# EAGLE schematic core (EAGLE 9.4.2), part 2 of 2
## Sheet 13 of 13: Connector
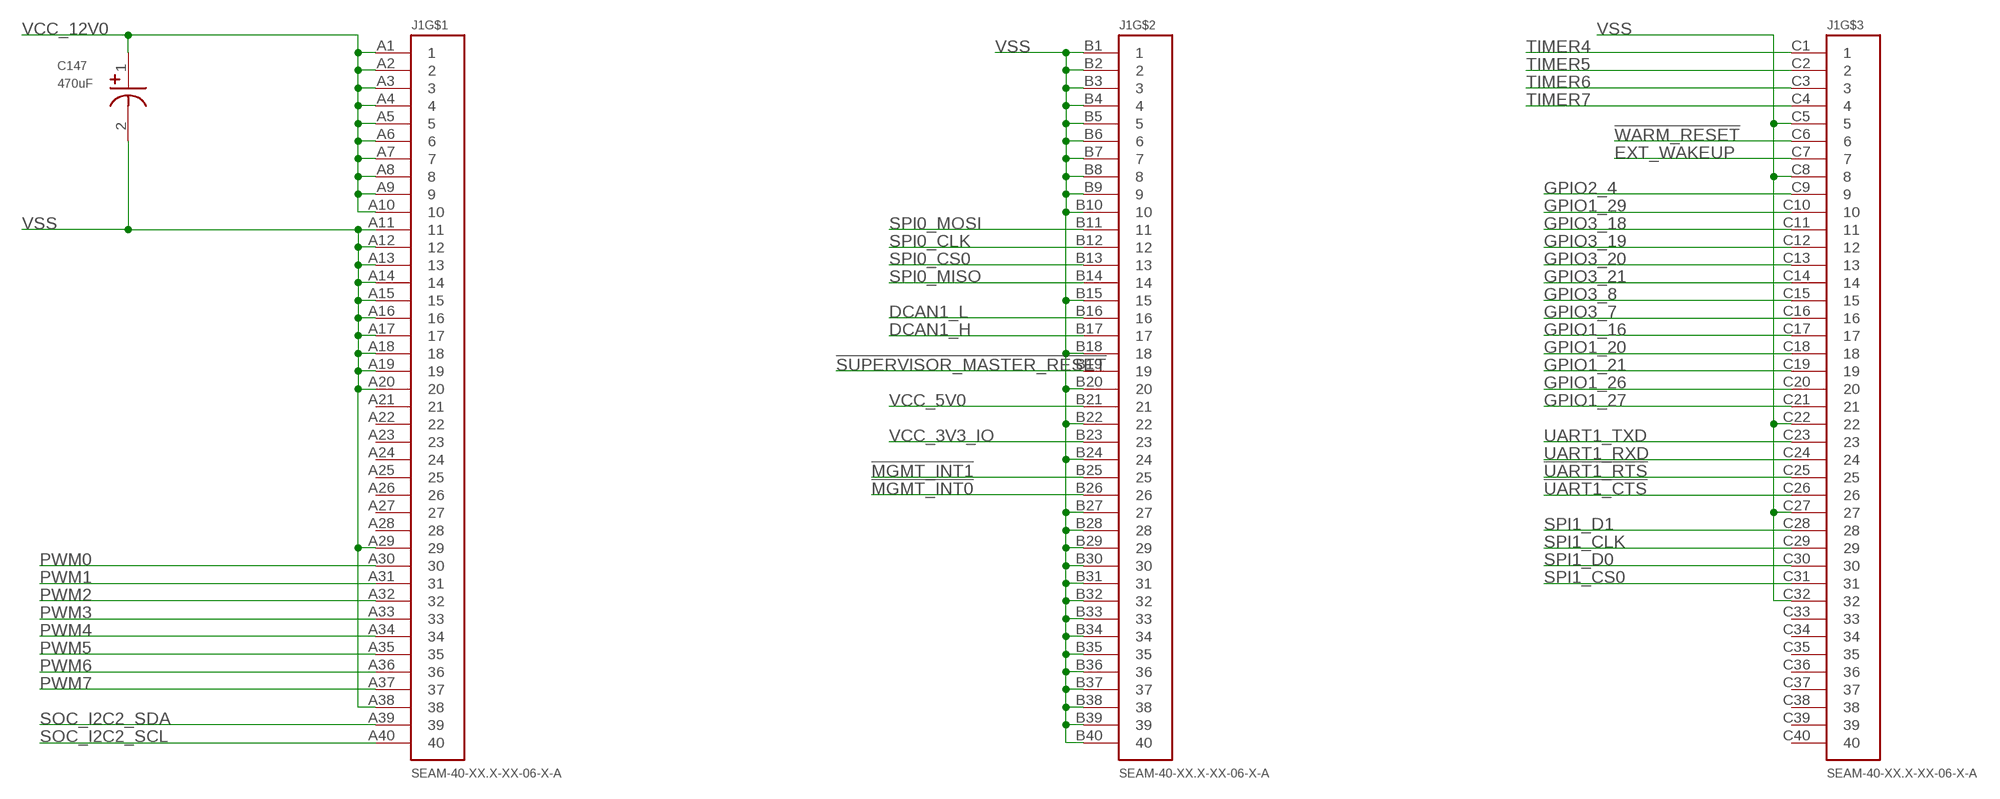
[diagram p14: schematic, sheet 13, part 1 of 2]
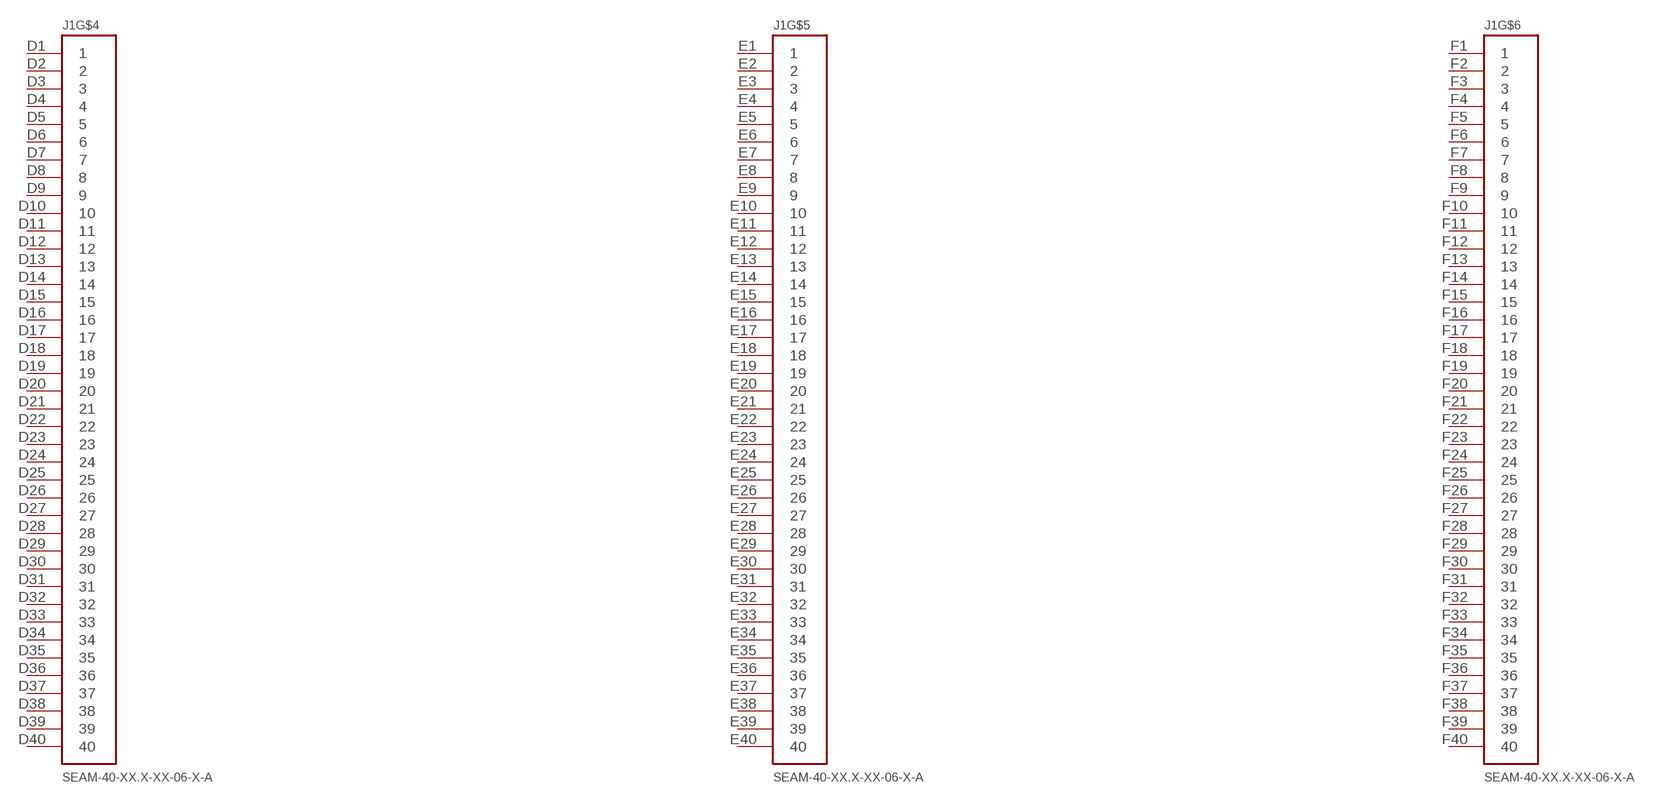
[diagram p15: schematic, sheet 13, part 2 of 2]

### Parts
C147  470uF  CAPACITOR_POLARIZED1  [CAPPRD300W65D800H1200B]
J1  SEAM-40-XX.X-XX-06-X-A  [SEAM-40-XX.X-XX-06-X-A]

### Nets
!MGMT_INT0: J1.B26 ; also sheet 12
!MGMT_INT1: J1.B25 ; also sheet 12
!SUPERVISOR_MASTER_RESET: J1.B19 ; also sheet 11
!UART1_CTS: J1.C26 ; also sheet 1
!UART1_RTS: J1.C25 ; also sheet 1
!WARM_RESET: J1.C6 ; also sheet 1
DCAN1_H [6mil]: J1.B17 ; also sheet 1
DCAN1_L [6mil]: J1.B16 ; also sheet 1
EXT_WAKEUP: J1.C7 ; also sheet 1,12
GPIO1_16: J1.C17 ; also sheet 1
GPIO1_20: J1.C18 ; also sheet 1
GPIO1_21: J1.C19 ; also sheet 1
GPIO1_26: J1.C20 ; also sheet 1
GPIO1_27: J1.C21 ; also sheet 1
GPIO1_29: J1.C10 ; also sheet 1
GPIO2_4: J1.C9 ; also sheet 1
GPIO3_7: J1.C16 ; also sheet 1
GPIO3_8: J1.C15 ; also sheet 1
GPIO3_18: J1.C11 ; also sheet 1
GPIO3_19: J1.C12 ; also sheet 1
GPIO3_20: J1.C13 ; also sheet 1
GPIO3_21: J1.C14 ; also sheet 1
PWM0: J1.A30 ; also sheet 7
PWM1: J1.A31 ; also sheet 7
PWM2: J1.A32 ; also sheet 7
PWM3: J1.A33 ; also sheet 7
PWM4: J1.A34 ; also sheet 7
PWM5: J1.A35 ; also sheet 7
PWM6: J1.A36 ; also sheet 7
PWM7: J1.A37 ; also sheet 7
SOC_I2C2_SCL: J1.A40 ; also sheet 1,9
SOC_I2C2_SDA: J1.A39 ; also sheet 1,9
SPI0_CLK: J1.B12 ; also sheet 1
SPI0_CS0: J1.B13 ; also sheet 1
SPI0_MISO: J1.B14 ; also sheet 1
SPI0_MOSI: J1.B11 ; also sheet 1
SPI1_CLK: J1.C29 ; also sheet 1
SPI1_CS0: J1.C31 ; also sheet 1
SPI1_D0: J1.C30 ; also sheet 1
SPI1_D1: J1.C28 ; also sheet 1
TIMER4: J1.C1 ; also sheet 1
TIMER5: J1.C2 ; also sheet 1
TIMER6: J1.C3 ; also sheet 1
TIMER7: J1.C4 ; also sheet 1
UART1_RXD: J1.C24 ; also sheet 1
UART1_TXD: J1.C23 ; also sheet 1
VCC_3V3_IO: J1.B23 ; also sheet 1,2,4,5,6,7,8,9,10,11,12
VCC_5V0: J1.B21 ; also sheet 1,5,6,9
VCC_12V0: C147.1(+) J1.A1 J1.A2 J1.A3 J1.A4 J1.A5 J1.A6 J1.A7 J1.A8 J1.A9 J1.A10 ; also sheet 9,11
VSS: C147.2(-) J1.A11 J1.A12 J1.A13 J1.A14 J1.A15 J1.A16 J1.A17 J1.A18 J1.A19 J1.A20 J1.A29 J1.A38 J1.B1 J1.B2 J1.B3 J1.B4 J1.B5 J1.B6 J1.B7 J1.B8 J1.B9 J1.B10 J1.B15 J1.B18 J1.B20 J1.B22 J1.B24 J1.B27 J1.B28 J1.B29 J1.B30 J1.B31 J1.B32 J1.B33 J1.B34 J1.B35 J1.B36 J1.B37 J1.B38 J1.B39 J1.B40 J1.C5 J1.C8 J1.C22 J1.C27 J1.C32 ; also sheet 1,2,3,4,5,6,7,8,9,10,11,12
Unconnected: J1.A21 J1.A22 J1.A23 J1.A24 J1.A25 J1.A26 J1.A27 J1.A28 J1.C33 J1.C34 J1.C35 J1.C36 J1.C37 J1.C38 J1.C39 J1.C40 J1.D1 J1.D2 J1.D3 J1.D4 J1.D5 J1.D6 J1.D7 J1.D8 J1.D9 J1.D10 J1.D11 J1.D12 J1.D13 J1.D14 J1.D15 J1.D16 J1.D17 J1.D18 J1.D19 J1.D20 J1.D21 J1.D22 J1.D23 J1.D24 J1.D25 J1.D26 J1.D27 J1.D28 J1.D29 J1.D30 J1.D31 J1.D32 J1.D33 J1.D34 J1.D35 J1.D36 J1.D37 J1.D38 J1.D39 J1.D40 J1.E1 J1.E2 J1.E3 J1.E4 J1.E5 J1.E6 J1.E7 J1.E8 J1.E9 J1.E10 J1.E11 J1.E12 J1.E13 J1.E14 J1.E15 J1.E16 J1.E17 J1.E18 J1.E19 J1.E20 J1.E21 J1.E22 J1.E23 J1.E24 J1.E25 J1.E26 J1.E27 J1.E28 J1.E29 J1.E30 J1.E31 J1.E32 J1.E33 J1.E34 J1.E35 J1.E36 J1.E37 J1.E38 J1.E39 J1.E40 J1.F1 J1.F2 J1.F3 J1.F4 J1.F5 J1.F6 J1.F7 J1.F8 J1.F9 J1.F10 J1.F11 J1.F12 J1.F13 J1.F14 J1.F15 J1.F16 J1.F17 J1.F18 J1.F19 J1.F20 J1.F21 J1.F22 J1.F23 J1.F24 J1.F25 J1.F26 J1.F27 J1.F28 J1.F29 J1.F30 J1.F31 J1.F32 J1.F33 J1.F34 J1.F35 J1.F36 J1.F37 J1.F38 J1.F39 J1.F40

## Power pins joined to a net without a drawn wire
VPP: U1.M5(E:VPP)

## Library data of the parts
C1-C33 C36-C141 C148-C239 C464 C465 C574 C575 C577-C579 = standardparts:CAPACITOR
C34 C35 C142-C147 = Module_Capacitors:CAPACITOR_POLARIZED
D1 D2 D5 D6 = standardparts:LED
HDMI = connectors:HDMI-A: Horizonal HDMI type "A" jack
J1 = SEAM-40-XX.X-XX-06-X-A:SEAM-40-XX.X-XX-06-X-A: Terminal Array Assembly, Surface Mount, 0.050 inch Pitch, 240 Pins
JP1 = pinhead:PINHD-2X10: PIN HEADER
JP2 = pinhead:PINHD-1X9: PIN HEADER
JP3 = pinhead:PINHD-2X5: PIN HEADER
Q8-Q11 = CSD18543Q3A:CSD18543Q3A: 60V N-Channel NexFET™ Power MOSFET 8-VSONP -55 to 150; AVAILABILITY: Unavailable; DESCRIPTION: 60V N-Channel NexFET™ Power MOSFET 8-VSONP -55 to 150; MF: Texas Instruments; MP: CSD18543Q3A; PACKAGE: VSON-8 Texas Instruments; PRICE: None
R1-R22 R25-R91 R94-R102 R202-R204 R206-R208 R211-R216 R218-R220 R229-R234 R243 R536-R538 R540-R543 = standardparts:RESISTOR
R205 R217 = adafruit:R-US_: RESISTOR, American symbol
T1 = con-3m:2908-: 3M Card Connector microSD Normal Polarisation, Push-Push, Surface-Mount, 2900 Series 2908-05WB-MG: Surface mount, right angle Supplier: DigiKey 3M5607CT-ND Source: http://solutions.3m.com/wps/portal/3M/en_US/FP/FireProtection/Products/ProductCatalog/?PC_7_RJH9U5230GE3E02LECFTDQ0R92_nid=GGFDLLB87CbeGKZPW31NMHgl
TP1 TP2 TP14 TP24-TP26 TP29 TP31 TP32 = BeagleBone_Blue_R3:TESTPAD_TPSQ: Test pad
U1 = Module_ICs:AM3354_ZCZ_324; DATASHEETURL: httpwww.ti.comlitgpnAM3354; FAMILY_NAME: ARM335x ARM CortexA8; GENERIC_PART_NUMBER: AM3354; INDUSTRY_STD_PKG_TYPE: NFBGA; MANUFACTURER: Texas Instruments; PACKAGE_DESIGNATOR: ZCZ; PIN_COUNT: 324
U2 U10 = Module_ICs:TPD4S012_DRY_6; DATASHEETURL: httpwww.ti.comlitgpnTPD4S012; FAMILY_NAME: ESD Solution; GENERIC_PART_NUMBER: TPD4S012; INDUSTRY_STD_PKG_TYPE: SON; MANUFACTURER: Texas Instruments; MANUFACTURER_PART_NUMBER: tpd4s012_dry_6; PACKAGE_DESIGNATOR: DRY; PIN_COUNT: 6; VENDOR: Texas Instruments
U3 U5 U7 U8 = Module_Regulators:INA226_DGS_10; DATASHEETURL: httpwww.ti.comlitgpnINA226; FAMILY_NAME: CURRENT SHUNT MONITOR; GENERIC_PART_NUMBER: INA226; INDUSTRY_STD_PKG_TYPE: MSOP; MANUFACTURER: Texas Instruments; MANUFACTURER_PART_NUMBER: ina226_dgs_10; PACKAGE_DESIGNATOR: DGS; PIN_COUNT: 10; VENDOR: Texas Instruments
U4 U38 = Module_Regulators:TPS62363YZHR; ALTERNATEPARTNUMBER: TPS62363YZHT; APPLICATION_BUILDNUMBER: *; COMPTYPE: IC; MANUFACTURER: Texas Instruments; MOUNTTYPE: SMT; PACKAGEREFERENCE: YZH0016AFAF; PARTNUMBER: TPS62363YZHR; PIN_COUNT: 16; REFDES: RefDes; ROHS: Y; TYPE: TYPE
U6 = Module_Regulators:TPS51116_PWP_20; DATASHEETURL: httpwww.ti.comlitgpnTPS51116; FAMILY_NAME: MULTIPLEOUTPUT SWITCHING CONTROLLER; GENERIC_PART_NUMBER: TPS51116; INDUSTRY_STD_PKG_TYPE: HTSSOP; MANUFACTURER: Texas Instruments; MANUFACTURER_PART_NUMBER: tps51116_pwp_20; PACKAGE_DESIGNATOR: PWP; PIN_COUNT: 20; VENDOR: Texas Instruments
U9 = Module_ICs:AS4C256M16D3B-12BIN
U11 U40 = Module_Regulators:LP5912-1.1DRVR; MANUFACTURER: Texas Instruments; PARTNUMBER: LP59121.1DRVR; REFDES: RefDes; TYPE: TYPE
U12 = Module_ICs:TCA9555_RTW_24; DATASHEETURL: httpwww.ti.comlitgpnTCA9555; FAMILY_NAME: I2C IO EXPANDER; GENERIC_PART_NUMBER: TCA9555; INDUSTRY_STD_PKG_TYPE: QFN; MANUFACTURER: Texas Instruments; MANUFACTURER_PART_NUMBER: tca9555_rtw_24; PACKAGE_DESIGNATOR: RTW; PIN_COUNT: 24; VENDOR: Texas Instruments
U13 = Module_ICs:SN74LVC1G04DCKR; ALTERNATEPARTNUMBER: SN74LVC1G04DCKT; COMPTYPE: IC; MANUFACTURER: Texas Instruments; MOUNTTYPE: SMT; PACKAGEREFERENCE: DCK0005A; PARTNUMBER: SN74LVC1G04DCKR; PIN_COUNT: 5; REFDES: RefDes; ROHS: Y; TYPE: TYPE
U14 = Module_ICs:DP83822HRHBR; MANUFACTURER: Texas Instruments; PARTNUMBER: DP83822HRHBR; REFDES: RefDes; TYPE: TYPE
U15 U16 = Module_Regulators:TPS2051B_D_8; DATASHEETURL: httpwww.ti.comlitgpnTPS2051B; FAMILY_NAME: USB POWER SWITCH; GENERIC_PART_NUMBER: TPS2051B; INDUSTRY_STD_PKG_TYPE: SOIC; MANUFACTURER: Texas Instruments; MANUFACTURER_PART_NUMBER: tps2051b_d_8; PACKAGE_DESIGNATOR: D; PIN_COUNT: 8; VENDOR: Texas Instruments
U17 = Module_ICs:TFP410_PAP_64; DATASHEETURL: httpwww.ti.comlitgpnTFP410; FAMILY_NAME: PANELBUS DVI; GENERIC_PART_NUMBER: TFP410; INDUSTRY_STD_PKG_TYPE: HTQFP; MANUFACTURER: Texas Instruments; MANUFACTURER_PART_NUMBER: tfp410_pap_64; PACKAGE_DESIGNATOR: PAP; PIN_COUNT: 64; VENDOR: Texas Instruments
U18 = Module_Regulators:TPD4E004_DRY_6; DATASHEETURL: httpwww.ti.comlitgpnTPD4E004; FAMILY_NAME: ESD Solution; GENERIC_PART_NUMBER: TPD4E004; INDUSTRY_STD_PKG_TYPE: SON; MANUFACTURER: Texas Instruments; MANUFACTURER_PART_NUMBER: tpd4e004_dry_6; PACKAGE_DESIGNATOR: DRY; PIN_COUNT: 6; VENDOR: Texas Instruments
U19 = Module_ICs:TCAN1042VDRQ1; MANUFACTURER: Texas Instruments; PARTNUMBER: TCAN1042VDRQ1; REFDES: RefDes; TYPE: TYPE
U34 = Module_Regulators:LM5140QRWGRQ1; MANUFACTURER: Texas Instruments; PARTNUMBER: LM5140QRWGRQ1; REFDES: RefDes; TYPE: TYPE
U35 = Module_Regulators:TPS62087RLTR; COMPTYPE: IC; MANUFACTURER: Texas Instruments; MOUNTTYPE: SMT; PACKAGEREFERENCE: RLT0007A; PARTNUMBER: TPS62087RLTR; PIN_COUNT: 7; REFDES: RefDes; ROHS: Y; TYPE: TYPE
U41 = Module_Regulators:TPS54334DRCR; ALTERNATEPARTNUMBER: TPS54334DRCT; APPLICATION_BUILDNUMBER: *; COMPTYPE: IC; MANUFACTURER: Texas Instruments; MOUNTTYPE: SMT; PACKAGEREFERENCE: DRC0010J; PARTNUMBER: TPS54334DRCR; PIN_COUNT: 11; REFDES: RefDes; ROHS: Y; TYPE: TYPE
U76 = Module_Regulators:TPS3711DDCR; MANUFACTURER: Texas Instruments; PARTNUMBER: TPS3711DDCR; REFDES: RefDes; TYPE: TYPE
U77 = Module_Regulators:TPS3897_DRY_6; DATASHEETURL: httpwww.ti.comlitgpnTPS3897; FAMILY_NAME: SUPERVISOR AND RESET IC; GENERIC_PART_NUMBER: TPS3897; INDUSTRY_STD_PKG_TYPE: SON; MANUFACTURER: Texas Instruments; MANUFACTURER_PART_NUMBER: tps3897_dry_6; PACKAGE_DESIGNATOR: DRY; PIN_COUNT: 6; VENDOR: Texas Instruments
U78 = Module_Gates:SN74LVC1G11_DCK_6; DATASHEETURL: httpwww.ti.comlitgpnSN74LVC1G11; FAMILY_NAME: LL AND GATE; GENERIC_PART_NUMBER: SN74LVC1G11; INDUSTRY_STD_PKG_TYPE: SC70; MANUFACTURER: Texas Instruments; MANUFACTURER_PART_NUMBER: sn74lvc1g11_dck_6; PACKAGE_DESIGNATOR: DCK; PIN_COUNT: 6; VENDOR: Texas Instruments
U$1 U$28 U$30 = Module_Inductors:XFL4015-471MEB
U$2 = Module_ICs:IRF7821
U$3 = Module_ICs:IRF7832
U$4 = Module_Inductors:XFL4020-102MEB
U$5 = Module_ICs:ECS-.327-12.5-1210B-N-TR
U$6 = Module_ICs:NX3225SA-26.000000MHZ-G3
U$7 = Module_ICs:ECS-250-18-36B-CKY-TR
U$9 = tmp10x:TMP100: Digital Temperature sensor from Texas Instruments Digital output : I2C Resolution : 9 to 12bit Accuracy : 2'C from -25'C to 85'C ; 3'C from -55'C to 125'C Supply : 2,7 to 5,5V / 45uA (standby 0,1uA)
U$10 U$11 = IS21ES16G:IS21ES16G
U$12 = nxp:PCA9685
U$20 U$21 = DB2441700L:DB2441700L
U$22 U$25 = Module_Inductors:XEL6030-152MEB
U$33 = Module_Inductors:XEL4030-682ME_
X1 = con-pulse:J1006F01P: PULSEJACK (TM) 1x1 Tab-UP RJ45 10/100 Base-TX RJ45 1x1 Tab-UP with LEDs 8-pin (J1 series) and 6-pin (JP series) integrated magnetics connector, designed to support applications, such as ADSL modems, LAN-on-Motherboard, and Hub and Switches. Source: www.pulseeng.com .. PulseJack-J402.pdf; OC_FARNELL: unknown; OC_NEWARK: unknown
X2 X3 = con-usb:USB: USB Connectors

## Net classes
1 6mil: width 0.152 mm, clearance 0.152 mm
2 5mil: width 0.127 mm, clearance 0.127 mm